# EAGLE design zeitschaltuhr_v2_0_0 (EAGLE 8.2.1)

## Sheet 1 of 2
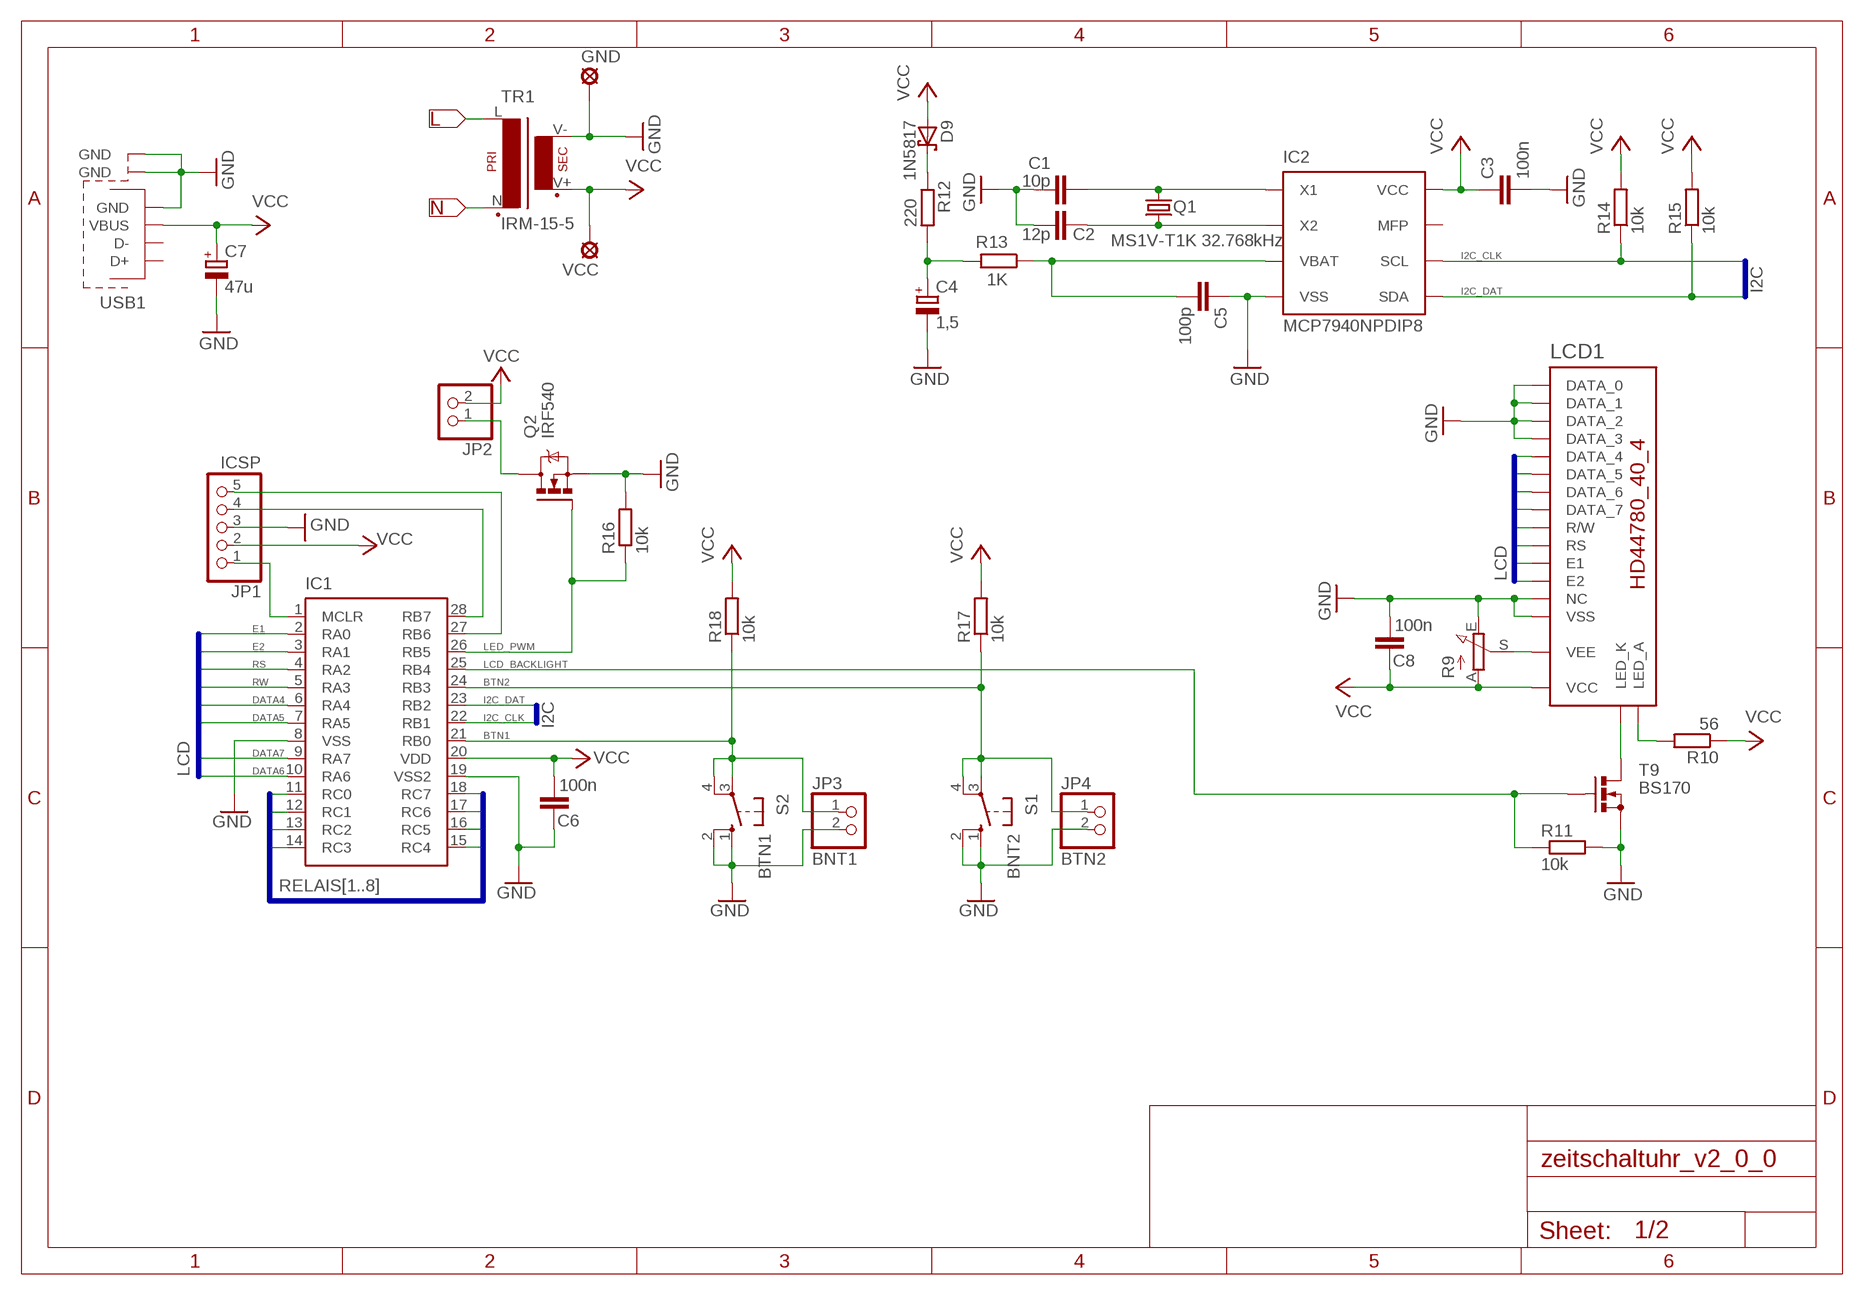
[diagram p0: schematic, sheet 1]

### Parts
C1  10p  C-EU025-024X044  [C025-024X044]
C2  12p  C-EU025-024X044  [C025-024X044]
C3  100n  C-EU025-024X044  [C025-024X044]
C4  1,5  DDL155S05F2CRRDAPZHORIZONTAL  [DDL155S05F2CRRDAPZHORIZONTAL]
C5  100p  C-EU025-024X044  [C025-024X044]
C6  100n  C-EU025-024X044  [C025-024X044]
C7  47u  CPOL-EUE2-5  [E2-5]
C8  100n  C-EU025-024X044  [C025-024X044]
D9  1N5817  SCHOTTKY  [DO41-7]
GND  LSP13  [LSP13]
IC1  PIC18F26K22DIP28  [DIP28]
IC2  MCP7940NPDIP8  [DIL8]
JP1  ICSP  PINHD-1X5  [1X05]
JP2  PINHD-1X2  [1X02]
JP3  BNT1  PINHD-1X2  [1X02]
JP4  BTN2  PINHD-1X2  [1X02]
LCD1  HD44780_4_40  [HD44780_40_4]
Q1  MS1V-T1K 32.768kHz  MS1V-T1KSMD  [MS1V-T1K_SMD]
Q2  IRF540  [TO220BV]
R9  3306P-1-103  [3306P-1-103]
R10  56  R-EU_0207/10  [0207/10]
R11  10k  R-EU_0207/10  [0207/10]
R12  220  R-EU_0207/10  [0207/10]
R13  1K  R-EU_0207/10  [0207/10]
R14  10k  R-EU_0207/10  [0207/10]
R15  10k  R-EU_0207/10  [0207/10]
R16  10k  R-EU_0207/10  [0207/10]
R17  10k  R-EU_0207/10  [0207/10]
R18  10k  R-EU_0207/10  [0207/10]
S1  BNT2  10-XX  [B3F-10XX]
S2  BTN1  10-XX  [B3F-10XX]
T9  BS170  [TO92-]
TR1  IRM-15-5  IRM-15  [IRM-15]
USB1  USB_TYPE_B_THT  [USB_TYPE_B_USB-B-S-RA]
VCC  LSP13  [LSP13]

### Nets
BTN1: IC1.21(RB0) JP3.1 R18.1 S2.3(P) S2.4(P1)
BTN2: IC1.24(RB3) JP4.1 R17.1 S1.3(P) S1.4(P1)
DATA4: IC1.6(RA4) LCD1.4(DATA_4)
DATA5: IC1.7(RA5) LCD1.3(DATA_5)
DATA6: IC1.10(RA6) LCD1.2(DATA_6)
DATA7: IC1.9(RA7) LCD1.1(DATA_7)
E1: IC1.2(RA0) LCD1.9(E1)
E2: IC1.3(RA1) LCD1.15(E2)
GND: C1.1 C2.1 C3.2 C4.- C5.1 C6.1 C7.- C8.2 GND.MP IC1.8(VSS) IC1.19(VSS2) IC2.4(VSS) JP1.3 JP3.2 JP4.2 LCD1.5(DATA_3) LCD1.6(DATA_2) LCD1.7(DATA_1) LCD1.8(DATA_0) LCD1.13(VSS) LCD1.16(NC) Q2.S R9.E R11.2 R16.2 S1.1(S) S1.2(S1) S2.1(S) S2.2(S1) T9.S TR1.V- USB1.GND@1(GND) USB1.GND@2(GND) USB1.GND@3(GND) ; also sheet 2
I2C_CLK: IC1.22(RB1) IC2.6(SCL) R14.1
I2C_DAT: IC1.23(RB2) IC2.5(SDA) R15.1
L: TR1.L ; also sheet 2
LCD_BACKLIGHT: IC1.25(RB4) R11.1 T9.G
LED_A: LCD1.17(LED_A) R10.2
LED_K: LCD1.18(LED_K) T9.D
LED_PWM: IC1.26(RB5) Q2.G R16.1
N: TR1.N ; also sheet 2
N$2: C1.2 IC2.1(X1) Q1.1
N$3: C2.2 IC2.2(X2) Q1.2
N$9: C4.+ R12.2 R13.2
N$10: D9.C R12.1
N$17: C5.2 IC2.3(VBAT) R13.1
N$19: IC1.1(MCLR) JP1.1
N$22: IC1.28(RB7) JP1.4
N$25: IC1.27(RB6) JP1.5
N$35: JP2.1 Q2.D
RELAIS1: IC1.11(RC0) ; also sheet 2
RELAIS2: IC1.12(RC1) ; also sheet 2
RELAIS3: IC1.13(RC2) ; also sheet 2
RELAIS4: IC1.14(RC3) ; also sheet 2
RELAIS5: IC1.15(RC4) ; also sheet 2
RELAIS6: IC1.16(RC5) ; also sheet 2
RELAIS7: IC1.17(RC6) ; also sheet 2
RELAIS8: IC1.18(RC7) ; also sheet 2
RS: IC1.4(RA2) LCD1.11(RS)
RW: IC1.5(RA3) LCD1.10(R/W)
VCC: C3.1 C6.2 C7.+ C8.1 D9.A IC1.20(VDD) IC2.8(VCC) JP1.2 JP2.2 LCD1.14(VCC) R9.A R10.1 R14.2 R15.2 R17.2 R18.2 TR1.V+ USB1.VBUS VCC.MP ; also sheet 2
VEE: LCD1.12(VEE) R9.S
Unconnected: IC2.7(MFP) USB1.D+ USB1.D-

### Buses
RELAIS[1..8]
I2C_CLK,I2C_DAT
E1,E2,RW,RS,DATA[4..7]

### Notes on the sheet
- I2C
- LCD
- I2C
- LCD

## Sheet 2 of 2
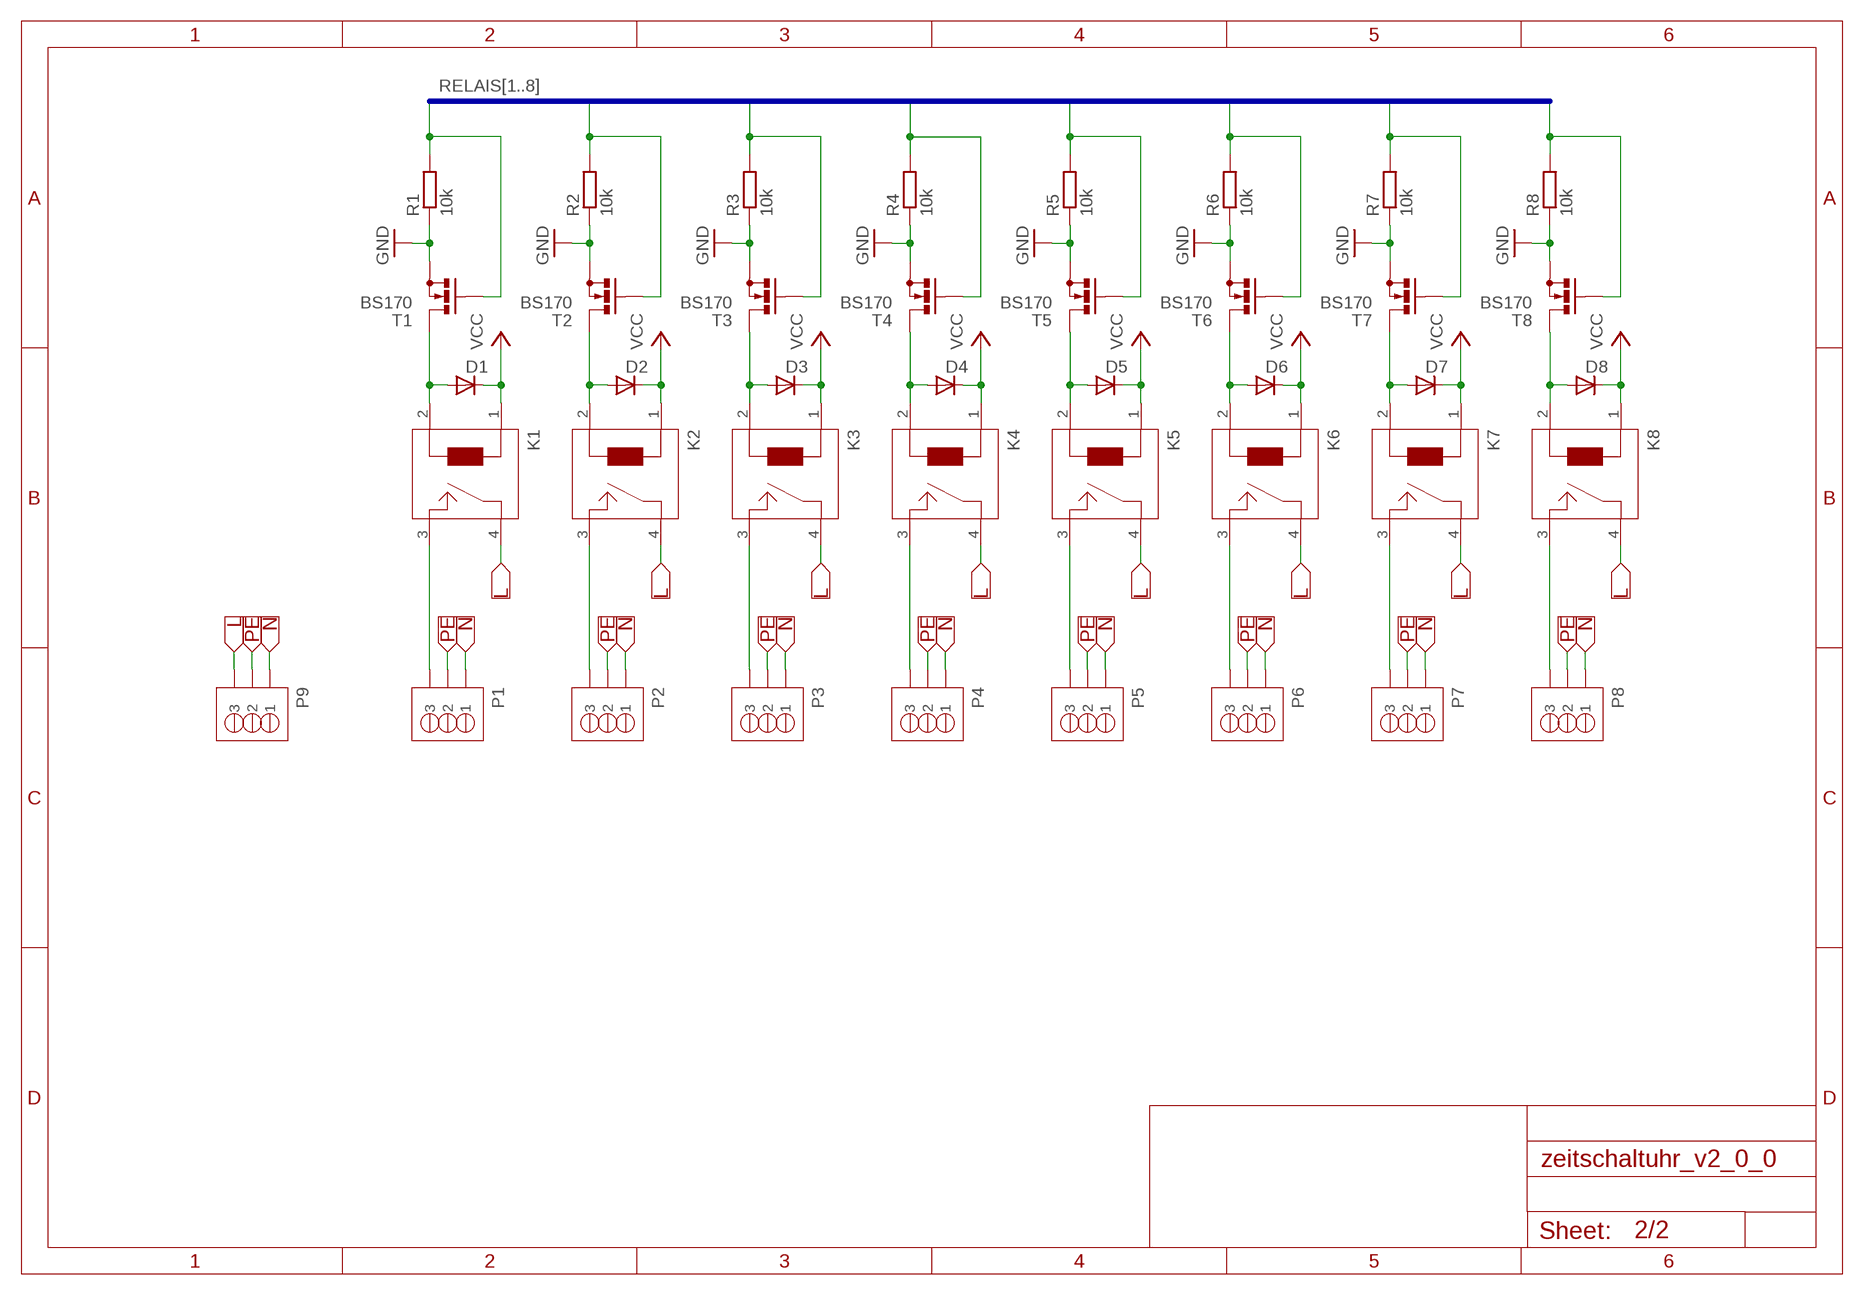
[diagram p1: schematic, sheet 2]

### Parts
D1  1N4148  DIODEDO35-7  [DO35-7]
D2  1N4148  DIODEDO35-7  [DO35-7]
D3  1N4148  DIODEDO35-7  [DO35-7]
D4  1N4148  DIODEDO35-7  [DO35-7]
D5  1N4148  DIODEDO35-7  [DO35-7]
D6  1N4148  DIODEDO35-7  [DO35-7]
D7  1N4148  DIODEDO35-7  [DO35-7]
D8  1N4148  DIODEDO35-7  [DO35-7]
K1  OJE-SS-105HM,000  [OJE-SS-105HM,000]
K2  OJE-SS-105HM,000  [OJE-SS-105HM,000]
K3  OJE-SS-105HM,000  [OJE-SS-105HM,000]
K4  OJE-SS-105HM,000  [OJE-SS-105HM,000]
K5  OJE-SS-105HM,000  [OJE-SS-105HM,000]
K6  OJE-SS-105HM,000  [OJE-SS-105HM,000]
K7  OJE-SS-105HM,000  [OJE-SS-105HM,000]
K8  OJE-SS-105HM,000  [OJE-SS-105HM,000]
P1  TERMINAL_BLOCK_MB310-500M03  [TERMINAL_BLOCK_MB310-500M03]
P2  TERMINAL_BLOCK_MB310-500M03  [TERMINAL_BLOCK_MB310-500M03]
P3  TERMINAL_BLOCK_MB310-500M03  [TERMINAL_BLOCK_MB310-500M03]
P4  TERMINAL_BLOCK_MB310-500M03  [TERMINAL_BLOCK_MB310-500M03]
P5  TERMINAL_BLOCK_MB310-500M03  [TERMINAL_BLOCK_MB310-500M03]
P6  TERMINAL_BLOCK_MB310-500M03  [TERMINAL_BLOCK_MB310-500M03]
P7  TERMINAL_BLOCK_MB310-500M03  [TERMINAL_BLOCK_MB310-500M03]
P8  TERMINAL_BLOCK_MB310-500M03  [TERMINAL_BLOCK_MB310-500M03]
P9  TERMINAL_BLOCK_MB310-500M03  [TERMINAL_BLOCK_MB310-500M03]
R1  10k  R-EU_0207/10  [0207/10]
R2  10k  R-EU_0207/10  [0207/10]
R3  10k  R-EU_0207/10  [0207/10]
R4  10k  R-EU_0207/10  [0207/10]
R5  10k  R-EU_0207/10  [0207/10]
R6  10k  R-EU_0207/10  [0207/10]
R7  10k  R-EU_0207/10  [0207/10]
R8  10k  R-EU_0207/10  [0207/10]
T1  BS170  [TO92-]
T2  BS170  [TO92-]
T3  BS170  [TO92-]
T4  BS170  [TO92-]
T5  BS170  [TO92-]
T6  BS170  [TO92-]
T7  BS170  [TO92-]
T8  BS170  [TO92-]

### Nets
GND: R1.1 R2.1 R3.1 R4.1 R5.1 R6.1 R7.1 R8.1 T1.S T2.S T3.S T4.S T5.S T6.S T7.S T8.S ; also sheet 1
L: K1.4 K2.4 K3.4 K4.4 K5.4 K6.4 K7.4 K8.4 P9.3 ; also sheet 1
N: P1.1 P2.1 P3.1 P4.1 P5.1 P6.1 P7.1 P8.1 P9.1 ; also sheet 1
N$1: D1.A K1.2 T1.D
N$4: D2.A K2.2 T2.D
N$8: D3.A K3.2 T3.D
N$12: D4.A K4.2 T4.D
N$13: K1.3 P1.3
N$14: K2.3 P2.3
N$16: D5.A K5.2 T5.D
N$18: D6.A K6.2 T6.D
N$21: D7.A K7.2 T7.D
N$24: D8.A K8.2 T8.D
N$27: K3.3 P3.3
N$28: K4.3 P4.3
N$29: K5.3 P5.3
N$30: K6.3 P6.3
N$31: K7.3 P7.3
N$32: K8.3 P8.3
PE: P1.2 P2.2 P3.2 P4.2 P5.2 P6.2 P7.2 P8.2 P9.2
RELAIS1: R1.2 T1.G ; also sheet 1
RELAIS2: R2.2 T2.G ; also sheet 1
RELAIS3: R3.2 T3.G ; also sheet 1
RELAIS4: R4.2 T4.G ; also sheet 1
RELAIS5: R5.2 T5.G ; also sheet 1
RELAIS6: R6.2 T6.G ; also sheet 1
RELAIS7: R7.2 T7.G ; also sheet 1
RELAIS8: R8.2 T8.G ; also sheet 1
VCC: D1.C D2.C D3.C D4.C D5.C D6.C D7.C D8.C K1.1 K2.1 K3.1 K4.1 K5.1 K6.1 K7.1 K8.1 ; also sheet 1

### Buses
RELAIS[1..8]

## Library data of the parts
C1-C3 C5 C6 C8 = rcl:C-EU: CAPACITOR, European symbol
C4 = condensator:DDL155S05F2CRRDAPZ: SUPERCAP; DDL155S05F2CRRDAPZ; 1,5F; 5,5V; 0,6Ohm SOURCE: /condensator/DDL155S05F2CRRDAPZ.pdf MANUFACTURER: SAMXON MANUF. NUBMBER: DDL155S05F2CRRDAPZ FARNELL: 2800113 BUY <http://at.farnell.com/samxon/ddl155s05f2crrdapz/doppelschichtkondensator-1-5f/dp/2800113> CONRAD: 457521 - 62 BUY <https://www.conrad.at/de/doppelschicht-kondensator-15-f-5-vdc-20-l-x-b-x-h-175-x-9-x-235-mm-samxon-ddl155s05f2crrdapz-1-st-457521.html>
C7 = rcl:CPOL-EU: POLARIZED CAPACITOR, European symbol
D1-D8 = diode:DIODE: DIODE
D9 = diode:SCHOTTKY: SCHOTTKY-DIODE
GND VCC = solpad:LSP13: SOLDER PAD drill 1.3 mm, distributor Buerklin, 12H562
IC1 = microcontroller:PIC18F26K22: Microcontroller, 8 bit, 18F26k22 SOURCE: /microcontroller/PIC18F26K22.pdf MANUFACTURER: Microchip MANUF. NUMBER: PIC18F26K22 FARNELL: 1814975 BUY <http://at.farnell.com/microchip/pic18f26k22-i-sp/mcu-8bit-64k-flash-xlp-28spdip/dp/1814975?st=pic18f26k22> CONRAD: 651698 - 62 BUY <https://www.conrad.at/de/embedded-mikrocontroller-pic18f26k22-isp-spdip-28-microchip-technology-8-bit-64-mhz-anzahl-io-24-651698.html>
IC2 = microcontroller:MCP7940N: RTCC, MCP7940N SOURCE: /microcontroller/MCP7940N.pdf MANUFACTURER: Microchip MANUF. NUMBER: MCP7940N FARNELL: 2361114 BUY <http://at.farnell.com/microchip/mcp7940n-i-p/echtz-uhr-kal-gp-i2c-64b-sram/dp/2361114?st=mcp7940>
JP1 = pinhead:PINHD-1X5: PIN HEADER
JP2-JP4 = pinhead:PINHD-1X2: PIN HEADER
K1-K8 = relay:OJE-SS-105HM,000: Relay OEG-TE CONNECTIFITY OJE-SS-105HM,000 5VDC, 10A, monostabil, SPST-NO SOURCE: /relay/OJE-SS-105HM_000.pdf MANUFACTURER: OEG-TE CONNECTIFITY MANUF. NUMBER: OJE-SS-105HM,000 FARNELL: 1891661 BUY <http://at.farnell.com/oeg-te-connectivity/oje-ss-105hm-000/relais-spst-no-250vac-30vdc-10a/dp/1891661> OTHER PARTS WITH SAME LAYOUT: CONRAD: 1405623 - 62 BUY <https://www.conrad.at/de/printrelais-5-vdc-10-a-1-schliesser-afe-bj-ss-105lm-1-st-1405623.html>
LCD1 = display:HD44780_4_40: HD44780_40_4 LC-Display SOURCE: /display/HD44780_40_4.pdf MANUFACTURER: EastRising MANUF. NUMBER: ERM4004-1 BUYDISPLAY.COM: ERM4004SBS-1 BUY <http://www.buydisplay.com/default/character-arduino-40x4-lcd-display-datasheet-ks0066-white-on-blue?options=cart>
P1-P9 = connector:TERMINAL_BLOCK_MB310-500M03: TERMINAL_BLOCK MB310-500M03 SOURCE: /connector/TERMINAL_BLOCK_MB310-500M03.pdf MANUFACTURER: DECA MANUF. NUMBER: MB310-500M03 CONRAD: 1188443 - 62 BUY <https://www.conrad.at/de/schraubklemmblock-330-mm-polzahl-3-mb310-500m03-deca-gruen-1-st-1188443.html>
Q1 = crystal:MS1V-T1K: MS1V-T1K WARNING: SMD SOLDERING RECOMMENDED, THT VERSION NOT EXISTING (VIRTUALLY ONLY) SOURCE: /crystal/MS1V-T1K.pdf MANUFACTURER: MicroCrystal MANUF. NUMBER: MS1V-T1K CONRAD: 1009252 - 62 BUY <https://www.conrad.at/de/uhrenquarz-microcrystal-ms1v-t1k-32768khz-7pf-20ppm-ta-qc-smd-2-32768-khz-7-pf-81-mm-2-mm-2-mm-1009252.html>
Q2 = transistor-power:IRF540: HEXFET Power MOSFET
R1-R8 R10-R18 = rcl:R-EU_: RESISTOR, European symbol
R9 = potentiometer:3306P-1-103: Potentiometer 3306P-1-103 MANUFACTURER: BOURNS MANUF. NUMBER: 3306P-1-103 SOURCE: /potentiometer/BOURNS_3306P-1-103.pdf FARNELL: 108239 BUY <http://at.farnell.com/bourns/3306p-1-103/trimmpotentiometer-10k/dp/108239> CONRAD: 447314 - 62 BUY <https://www.conrad.at/de/trimmer-linear-02-w-10-k-260-bourns-3306p-1-103-1-st-447314.html>
S1 S2 = switch-omron:10-XX: OMRON SWITCH; MPN: B3F-1000; OC_FARNELL: 176432; OC_NEWARK: 36M3542
T1-T9 = transistor:BS170: N-CHANNEL MOS FET BS170 SOURCE: /transistor/BS170.pdf MANUFACTURER: OM SEMICONDUCTER MANUF. NUMBER: BS170 FARNELL: 1017687 BUY <http://at.farnell.com/on-semiconductor/bs170/mosfet-n-kanal-500ma-60v-to92/dp/1017687?st=bs170>
TR1 = power:IRM-15: Meanwell IRM-15 Printtrafo SOURCE: /power/AC_DC_IRM-15.pdf MANUFACTURER: MEANWELL MANUF. NUMBER: IRM-15-* (*Output voltage) REICHELT: IRM-15-5 BUY <https://www.reichelt.at/Wandler-Module-AC-DC/IRM-15-5/3/index.html?ACTION=3&LA=2&ARTICLE=157857&GROUPID=7242&artnr=IRM-15-5&trstct=pol_8> CONRAD: 1293871 - 62 BUY <https://www.conrad.at/de/acdc-printnetzteil-mean-well-irm-15-5-5-vdc-3-a-15-w-1293871.html>
USB1 = connector:USB_TYPE_B_THT: USB TYPE B Connector SOURCE: /connector/USB_TYPE_B_USB-B-S-RA.pdf PINOUT: /connector/USB_TYPE_B_PINOUT.jpg MANUFACTURER: multicomp MANUF. NUMBER: USB-B-S-RA FARNELL: 2112373 BUY <http://at.farnell.com/multicomp/usb-b-s-ra/usb-2-0-buchse-typ-b-tht/dp/2112373> OTHER PARTS WITH SAME LAYOUT: CONRAD: 1303504 - 62 BUY <https://www.conrad.at/de/usb-b-printbuchse-buchse-einbau-horizontal-usbbu1b-1-port-econ-connect-inhalt-1-st-1303504.html>

## Board
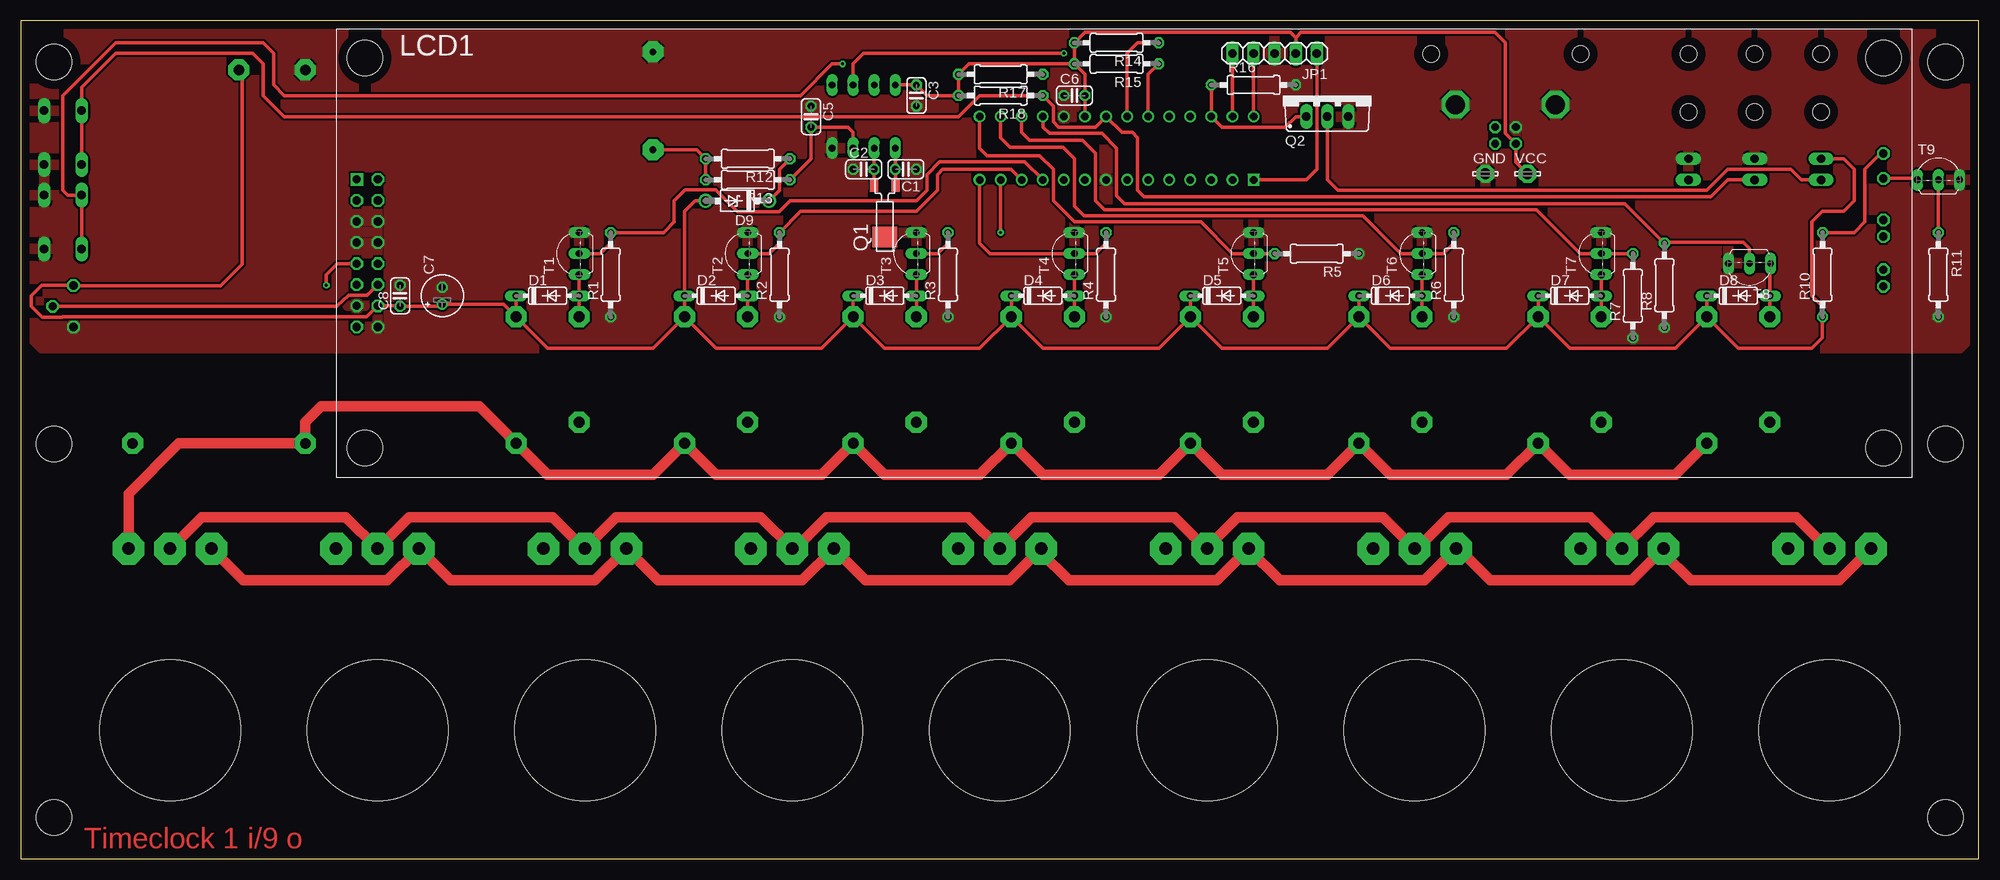
[diagram p2: board, top side]
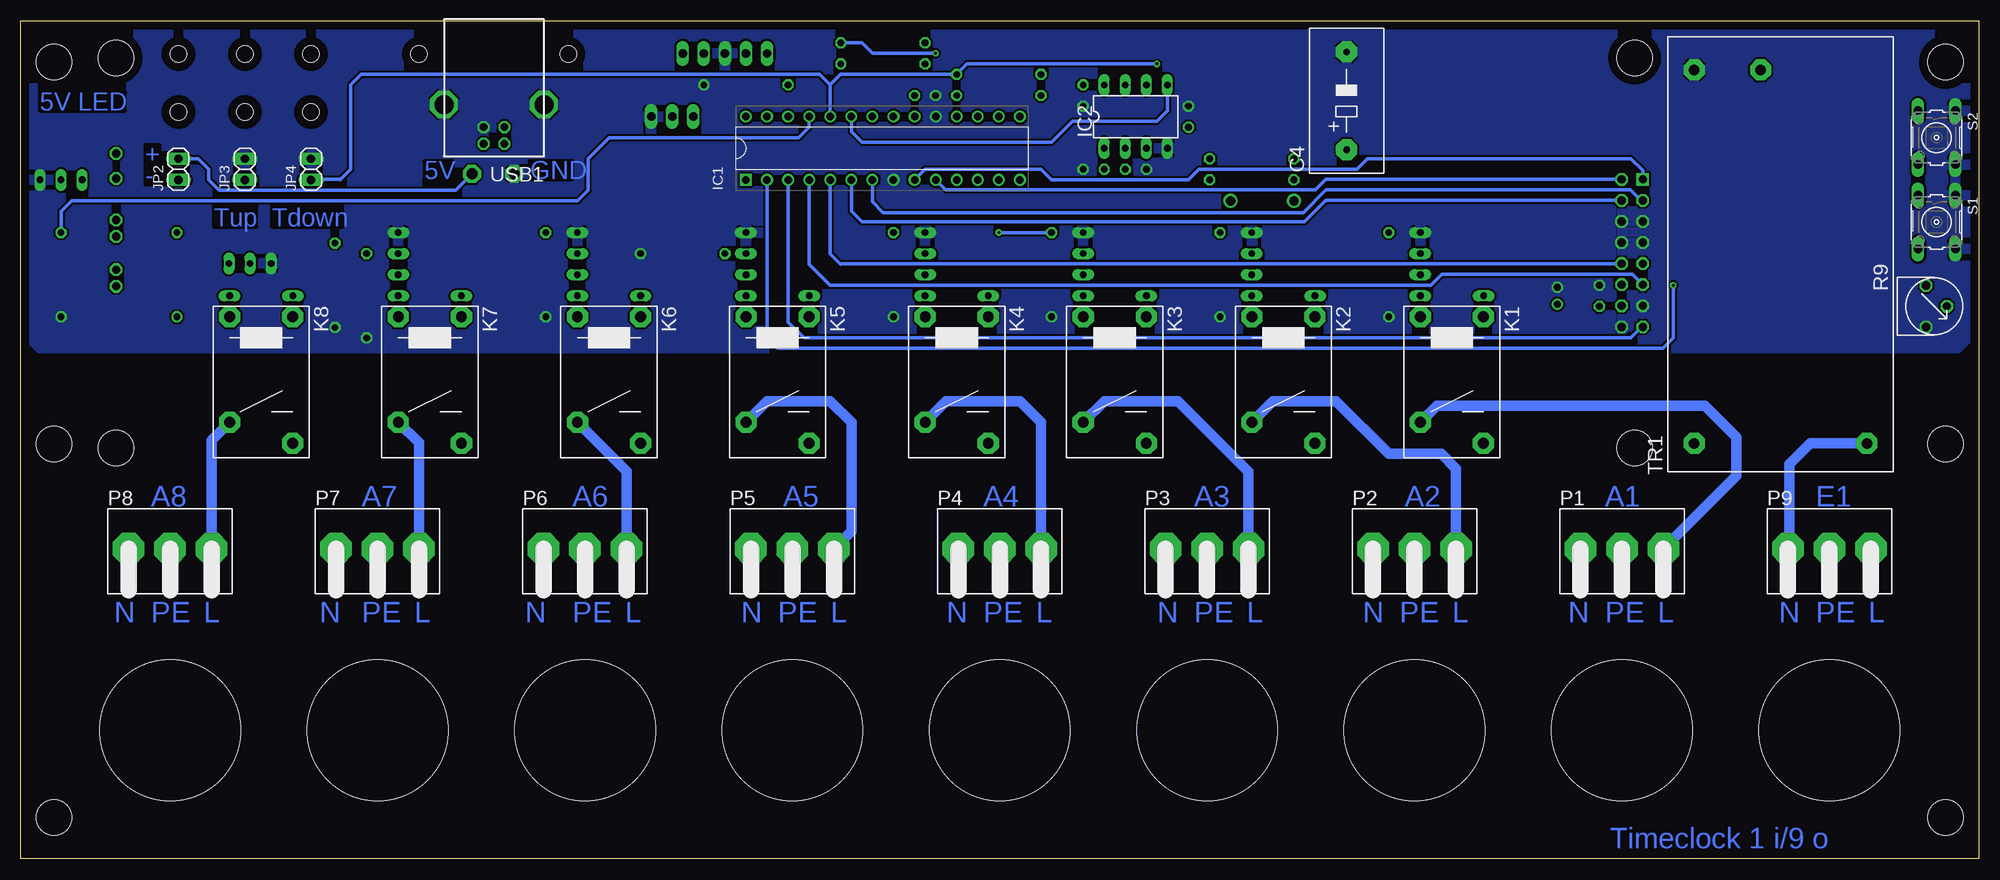
[diagram p3: board, bottom side, seen from below]

Size 236 x 101 mm. Coordinates in mm from the lower left corner, seen from the top.
Outline: 0,0 236,0 236,101 0,101 0,0
Copper layers (1*16): Top 0.035mm / dielectric 1.5mm / Bottom 0.035mm
Design rules "default *": minimum track width 6mil, minimum drill 0.35mm, track to track 10mil, track to pad 10mil, pad to pad 10mil, via to via 10mil, smd to smd 10mil, copper to edge 40mil, drill to drill 6mil, minimum pad ring 10mil, minimum via ring 8mil, stop-mask expansion 4mil, vias tented up to drill 0mil, thermal gap 10mil
Holes 4.3 mm at 232,96 232,50 4,50 4,96 4,5 232,5
Holes 17 mm at 43,15.52 68,15.52 93,15.52 118,15.52 143,15.52 168,15.52 193,15.52 218,15.52 18,15.52
Holes 2 mm at 217,90 209,90 201,90 201,97 209,97 217,97 170,97 188,97
tKeepout: area 213,86 to 221,101; area 205,86 to 213,101; area 197,86 to 205,101

### Footprints (pad centres in the part's own frame; a part is rotated, then mirrored left to right if it is on the bottom)
C025-024X044 = drill 0.813 octagon: 1 -1.27,0; 2 1.27,0
DDL155S05F2CRRDAPZHORIZONTAL = drill 0.8 pad 2.54 octagon: + -5.9,0; - 5.9,0
E2-5 = drill 0.813 pad 1.27: + -1.016,0 | drill 0.813 pad 1.27 octagon: - 1.016,0
DO35-7 = drill 0.813 long: A 3.81,0; C -3.81,0
DO41-7 = drill 1.118: A 3.81,0; C -3.81,0
LSP13 = drill 1.321 pad 2.159 octagon: MP 0,0
DIP28 = drill 0.9 square: 1 -3.81,15.24 | drill 0.9: 2 -3.81,12.7; 3 -3.81,10.16; 4 -3.81,7.62; 5 -3.81,5.08; 6 -3.81,2.54; 7 -3.81,0; 8 -3.81,-2.54; 9 -3.81,-5.08; 10 -3.81,-7.62; 11 -3.81,-10.16; 12 -3.81,-12.7; 13 -3.81,-15.24; 14 -3.81,-17.78; 15 3.81,-17.78; 16 3.81,-15.24; 17 3.81,-12.7; 18 3.81,-10.16; 19 3.81,-7.62; 20 3.81,-5.08; 21 3.81,-2.54; 22 3.81,0; 23 3.81,2.54; 24 3.81,5.08; 25 3.81,7.62; 26 3.81,10.16; 27 3.81,12.7; 28 3.81,15.24
DIL8 = drill 0.813 long: 1 -3.81,-3.81; 2 -1.27,-3.81; 3 1.27,-3.81; 4 3.81,-3.81; 5 3.81,3.81; 6 1.27,3.81; 7 -1.27,3.81; 8 -3.81,3.81
1X05 = drill 1.016 long: 1 -5.08,0; 2 -2.54,0; 3 0,0; 4 2.54,0; 5 5.08,0
1X02 = drill 1.016 long: 1 -1.27,0; 2 1.27,0
OJE-SS-105HM,000 = drill 1.3 pad 2.54 octagon: 1 -6.35,3.8; 2 -6.35,-3.8; 3 6.35,-3.8; 4 8.89,3.8
HD44780_40_4 = drill 1 square: 1 2.5,35.89 | drill 1 octagon: 2 5.04,35.89; 3 2.5,33.35; 4 5.04,33.35; 5 2.5,30.81; 6 5.04,30.81; 7 2.5,28.27; 8 5.04,28.27; 9 2.5,25.73; 10 5.04,25.73; 11 2.5,23.19; 12 5.04,23.19; 13 2.5,20.65; 14 5.04,20.65; 15 2.5,18.11; 16 5.04,18.11; 17 186.5,39; 18 186.5,36 | drill 1 pad 1.27 octagon: P$1 186.5,31; P$2 186.5,29; P$3 186.5,25; P$4 186.5,23 | hole 4.3: 3.5,50.5; 3.5,3.5; 186.5,3.5; 186.5,50.5
TERMINAL_BLOCK_MB310-500M03 = drill 1.5 pad 3.81 octagon: 1 -5,0; 2 0,0; 3 5,0
MS1V-T1K_SMD = smd 1.6 x 1: 1 0,-1.3; 2 0,1.3 | smd 2.5 x 3: NC -6.25,0
TO220BV = drill 1.016 long: D 0,-2.54; G -2.54,-2.54; S 2.54,-2.54
0207/10 = drill 0.813 octagon: 1 -5.08,0; 2 5.08,0
3306P-1-103 = drill 1 octagon: A -2.5,0; E 2.5,0; S 0,2.5
B3F-10XX = drill 1.016 long: 1 -3.251,2.261; 2 3.251,2.261; 3 -3.251,-2.261; 4 3.251,-2.261
TO92- = drill 0.813 long: D -2.54,0; G 0,0; S 2.54,0
IRM-15 = drill 1.27 pad 2.54 octagon: L 0,0; N 0,-20.8; V+ 45,-8; V- 45,0
USB_TYPE_B_USB-B-S-RA = drill 0.92 octagon: D+ -1.25,0; D- -1.25,2; GND@1 1.25,0; VBUS 1.25,2 | drill 2.3 octagon: GND@2 6.02,-2.71; GND@3 -6.02,-2.71

### Placement (x,y rotation side)
C1  106.68,83.1 180 top
C2  101.6,83.1 0 top
C3  107.95,91.99 270 top
C4  76.2,91.36 90 bottom
C5  95.25,89.45 270 top
C6  127,91.99 0 top
C7  50.8,67.86 90 top
C8  45.72,67.86 90 top
D1  63.5,67.86 0 top
D2  83.82,67.86 0 top
D3  104.14,67.86 0 top
D4  123.19,67.86 0 top
D5  144.78,67.86 0 top
D6  165.1,67.86 0 top
D7  186.69,67.86 0 top
D8  207.01,67.86 0 top
D9  86.36,79.29 180 top
GND  176.53,82.55 0 top
IC1  133.35,85.64 90 bottom
IC2  101.6,89.45 0 bottom
JP1  151.13,97.07 180 top
JP2  217,83.1 90 bottom
JP3  209,83.1 90 bottom
JP4  201,83.1 90 bottom
K1  63.5,58.97 270 bottom
K2  83.82,58.97 270 bottom
K3  104.14,58.97 270 bottom
K4  123.19,58.97 270 bottom
K5  144.78,58.97 270 bottom
K6  165.1,58.97 270 bottom
K7  186.69,58.97 270 bottom
K8  207.01,58.97 270 bottom
LCD1  38,46 0 top
P1  43,37.38 0 bottom
P2  68,37.38 0 bottom
P3  93,37.38 0 bottom
P4  118,37.38 0 bottom
P5  143,37.38 0 bottom
P6  168,37.38 0 bottom
P7  193,37.38 0 bottom
P8  218,37.38 0 bottom
P9  18,37.38 0 bottom
Q1  104.14,81.19 90 top
Q2  157.48,91.99 0 top
R1  71.12,70.4 90 top
R2  91.44,70.4 90 top
R3  111.76,70.4 90 top
R4  130.81,70.4 90 top
R5  156.21,72.94 180 top
R6  172.72,70.4 90 top
R7  194.31,67.86 90 top
R8  198.12,69.13 90 top
R9  6.35,66.59 270 bottom
R10  217.17,70.4 90 top
R11  231.14,70.4 270 top
R12  87.63,84.37 180 top
R13  87.63,81.83 180 top
R14  132.08,98.34 180 top
R15  132.08,95.8 180 top
R16  148.59,93.26 0 top
R17  118.11,94.53 180 top
R18  118.11,91.99 180 top
S1  5.08,76.75 270 bottom
S2  5.08,86.91 270 bottom
T1  67.31,72.94 90 top
T2  87.63,72.94 90 top
T3  107.95,72.94 90 top
T4  127,72.94 90 top
T5  148.59,72.94 90 top
T6  168.91,72.94 90 top
T7  190.5,72.94 90 top
T8  208.37,71.75 180 top
T9  231.14,81.83 0 top
TR1  34.29,50.08 90 bottom
USB1  178.96,88.18 180 bottom
VCC  181.61,82.55 0 top

### Tracks (layer width: path | path; a pad name or v marks a point on that pad's centre or on a via)
BTN1
  Top 0.406: S2.4 S2.3 7.34,92.98 11.43,97.07 27.94,97.07 29.21,95.8 29.21,91.99 31.75,89.45 113.03,89.45 115.57,91.99 R18.1 124.46,90.72 124.46,88.81 125.09,88.18 129.54,88.18 IC1.21 132.72,87.55 133.99,87.55 134.62,86.91 134.62,80.56 135.38,79.8 203.71,79.8 205.74,81.83 JP3.1
BTN2  (via drill 0.35)
  Top 0.406: v99.06,95.8 97.79,95.8 93.98,91.99 31.75,91.99 30.48,93.26 30.48,97.07 29.21,98.34 11.43,98.34 5.08,91.99 5.08,80.56 5.64,80 S1.3 S1.4
  Bottom 0.406: 138.43,93.26 137.16,94.53 R17.1 121.92,95.8 v99.06,95.8 | IC1.24 138.43,93.26 | 138.43,93.26 139.7,94.53 194.94,94.53 196.22,93.26 196.22,83.1 197.44,81.87 | 197.44,81.87 197.49,81.83 | 197.44,81.87 200.96,81.87 JP4.1
DATA4
  Bottom 0.406: LCD1.4 78.68,79.35 81.28,76.75 134.62,76.75 135.89,78.02 IC1.6
DATA5
  Bottom 0.406: LCD1.3 40.7,79.35 41.97,80.62 78.68,80.62 81.41,77.89 132.08,77.89 133.35,79.16 IC1.7
DATA6
  Bottom 0.406: LCD1.2 78.68,81.89 79.95,80.62 124.52,80.62 IC1.10
DATA7
  Bottom 0.406: LCD1.1 40.5,82.96 41.91,84.37 73.66,84.37 74.93,83.1 93.98,83.1 95.25,81.83 111.76,81.83 113.03,83.1 127,83.1 IC1.9
E1  (via drill 0.35)
  Top 0.406: LCD1.9 38.16,71.73 36.83,70.4 v36.83,69.13
  Bottom 0.406: IC1.2 146.05,62.78 144.78,61.51 38.1,61.51 36.83,62.78 v36.83,69.13
E2
  Bottom 0.406: IC1.3 143.51,64.69 141.6,62.78 41.91,62.78 40.58,64.11 LCD1.15
GND
  pour Bottom: 1.27,62.78 2.54,61.51 233.68,61.51 234.95,62.78 234.95,98.34 233.68,99.61 2.54,99.61 1.27,98.34
  pour Top: 1.27,62.78 2.54,61.51 233.68,61.51 234.95,62.78 234.95,98.34 233.68,99.61 2.54,99.61 1.27,98.34
I2C_CLK  (via drill 0.35)
  Top 0.406: IC1.22 133.35,97.07 134.62,98.34 R14.1 | IC2.6 100.33,95.8 101.6,97.07 v125.73,97.07
  Bottom 0.406: v125.73,97.07 133.35,97.07 134.62,98.34 R14.1
I2C_DAT
  Top 0.406: IC1.23 135.89,94.53 R15.1
  Bottom 0.406: IC1.23 135.89,87.63 134.62,86.36 111.76,86.36 109.22,88.9 99.06,88.9 97.79,90.17 IC2.5
L
  Top 1.27: K8.4 199.4,46.27 186.69,46.27 K7.4 179.08,46.27 165.1,46.27 K6.4 157.49,46.27 144.78,46.27 K5.4 137.17,46.27 123.19,46.27 K4.4 115.58,46.27 104.14,46.27 K3.4 96.53,46.27 83.82,46.27 K2.4 76.21,46.27 63.5,46.27 K1.4 55.24,54.52 36.2,54.52 34.29,52.62 TR1.L 19.05,50.08 13,44.03 P9.3
LCD_BACKLIGHT
  Top 0.406: T9.G R11.1
  Bottom 0.406: IC1.25 140.97,88.18 142.24,86.91 165.1,86.91 167.64,84.37 167.64,80.56 168.91,79.29 229.87,79.29 231.14,78.02 R11.1
LED_A
  Top 0.406: LCD1.17 224.15,85 222.25,83.1 222.25,76.75 220.98,75.48 R10.2
LED_K
  Top 0.406: LCD1.18 228.43,82 T9.D
LED_PWM
  Top 0.406: R16.1 IC1.26 144.78,88.18 152.4,88.18 153.67,89.45 Q2.G
N
  Top 1.27: P8.1 219.19,33.57 201.28,33.57 198,36.85 P7.1 194.19,33.57 177.15,33.57 173.34,37.38 P6.1 169.19,33.57 151.75,33.57 148,37.32 P5.1 144.19,33.57 126.35,33.57 123,36.92 P4.1 119.19,33.57 101.81,33.57 P3.1 94.19,33.57 76.82,33.57 P2.1 69.19,33.57 51.81,33.57 P1.1 44.19,33.57 26.81,33.57 P9.1
  Bottom 1.27: TR1.N 20.32,50.08 22.86,47.54 22.86,37.52 P9.1
N$1
  Top 0.406: T1.D D1.A K1.2
N$2
  Top 0.406: Q1.1 105.41,81.22 C1.2 IC2.1
N$3
  Top 0.406: Q1.2 102.87,81.22 C2.2 IC2.2
N$4
  Top 0.406: T2.D D2.A K2.2
N$8
  Top 0.406: T3.D D3.A K3.2
N$9
  Top 0.406: R13.2 R12.2 81.47,85.45 C4.+
N$10
  Top 0.406: D9.C 91.44,80.56 91.44,83.1 R12.1
N$12
  Top 0.406: T4.D D4.A K4.2
N$13
  Bottom 1.27: P1.3 29.21,46.17 29.21,50.8 33.02,54.61 65.31,54.61 K1.3
N$14
  Bottom 1.27: P2.3 63,47.04 64.77,48.81 71.12,48.81 77.47,55.16 85.08,55.16 K2.3
N$16
  Top 0.406: T5.D D5.A K5.2
N$17
  Top 0.406: IC2.3 100.33,87.55 99.69,88.18 C5.2 95.25,84.37 R13.1
N$18
  Top 0.406: T6.D D6.A K6.2
N$19
  Top 0.406: IC1.1 154.94,81.83 156.21,83.1 JP1.1
N$21
  Top 0.406: K7.2 D7.A T7.D
N$22
  Top 0.406: JP1.4 IC1.28
N$24
  Top 0.406: K8.2 D8.A 210.82,71.67 T8.D
N$25
  Top 0.406: IC1.27 JP1.5
N$27
  Bottom 1.27: P3.3 88,46.64 96.52,55.16 105.4,55.16 K3.3
N$28
  Bottom 1.27: P4.3 113,52.59 115.57,55.16 124.45,55.16 K4.3
N$29
  Bottom 1.27: P5.3 135.89,39.49 135.89,52.62 138.43,55.16 146.04,55.16 K5.3
N$30
  Bottom 1.27: P6.3 163,46.72 K6.3
N$31
  Bottom 1.27: P7.3 188,50.13 K7.3
N$32
  Bottom 1.27: P8.3 213,50.43 K8.3
N$35
  Top 0.406: Q2.D 157.48,81.83 158.75,80.56 203.2,80.56 205.74,83.1 213.36,83.1 214.63,81.83 JP2.1
PE
  Top 1.27: P8.2 217.79,37.38 213.98,41.19 196.81,41.19 P7.2 189.19,41.19 172.07,41.19 168.26,37.38 P6.2 164.19,41.19 146.67,41.19 143,37.52 P5.2 142.86,37.38 139.05,41.19 121.81,41.19 P4.2 114.19,41.19 97.14,41.19 93.33,37.38 P3.2 89.19,41.19 71.74,41.19 68,37.45 P2.2 67.93,37.38 64.12,41.19 46.81,41.19 P1.2 39.19,41.19 21.81,41.19 P9.2
RELAIS1
  Top 0.406: T1.G 69.85,72.94 71.12,74.21 R1.2 77.47,75.48 78.74,76.75 78.74,79.29 80.07,80.62 83.76,80.62 86.42,77.96 91.38,77.96 92.71,79.29 107.95,79.29 109.22,80.56 109.22,82.47 110.74,83.99 120.97,83.99 IC1.11
RELAIS2
  Top 0.406: T2.G 90.17,72.94 91.44,74.21 R2.2 93.98,78.02 107.95,78.02 110.49,80.56 110.49,82.47 111.12,83.1 119.38,83.1 IC1.12
RELAIS3  (via drill 0.35)
  Top 0.406: T3.G 110.49,72.94 111.76,74.21 R3.2 | v118.11,75.48 IC1.13
  Bottom 0.406: R3.2 v118.11,75.48
RELAIS4
  Top 0.406: R4.2 130.81,74.21 129.54,72.94 T4.G 116.84,72.94 115.57,74.21 IC1.14
RELAIS5
  Top 0.406: IC1.15 115.57,85.64 116.46,84.75 122.81,84.75 124.46,83.1 124.46,79.29 127,76.75 142.24,76.75 146.05,72.94 T5.G R5.2
RELAIS6
  Top 0.406: IC1.16 118.11,86.91 119.25,85.77 125.6,85.77 127,84.37 127,78.66 128.14,77.51 161.8,77.51 166.37,72.94 T6.G 171.45,72.94 172.72,74.21 R6.2
RELAIS7
  Top 0.406: IC1.17 120.65,87.55 121.6,86.59 127.95,86.59 129.54,85 129.54,79.29 130.62,78.21 182.69,78.21 187.96,72.94 T7.G R7.2
RELAIS8
  Top 0.406: IC1.18 123.19,88.18 124.02,87.42 130.3,87.42 132.08,85.64 132.08,79.92 133.03,78.97 193.36,78.97 R8.2 198.21,74.3 207.65,74.3 208.37,73.58 T8.G
RS
  Bottom 0.406: IC1.4 140.97,71.67 138.43,69.13 66.04,69.13 64.71,70.46 41.77,70.46 LCD1.11
RW
  Bottom 0.406: LCD1.10 137.1,71.73 | 137.1,71.73 137.16,71.67 | 137.1,71.73 137.22,71.73 138.43,72.94 IC1.5
VCC
  Top 0.406: K1.1 58.18,66.84 C7.+ 50.55,66.59 C8.1 45.66,66.65 LCD1.14 41.71,65.32 40,65.32 5.08,65.32 5.02,65.26 2.6,65.26 1.27,66.59 1.27,67.86 2.54,69.13 6.31,69.13 R9.A 24.09,69.09 26.67,71.67 26.67,94.7 TR1.V+ | K1.1 D1.C | K2.1 D2.C 80.01,78.02 81.28,79.29 D9.A | K1.1 63.5,61.51 76.21,61.51 K2.1 | K2.1 83.82,61.51 96.53,61.51 K3.1 | K3.1 104.14,61.51 115.58,61.51 K4.1 | K4.1 123.19,61.51 137.17,61.51 K5.1 | K5.1 144.78,61.51 157.49,61.51 K6.1 | K6.1 165.1,61.51 179.08,61.51 K7.1 | K7.1 186.69,61.51 199.4,61.51 K8.1 | K8.1 D8.C | K8.1 207.01,61.51 215.9,61.51 217.17,62.78 R10.1 217.17,66.59 215.9,67.86 215.9,76.75 217.17,78.02 219.71,78.02 220.98,79.29 220.98,83.1 219.71,84.37 JP2.2 | K7.1 D7.C | K6.1 D6.C | K5.1 D5.C | K4.1 D4.C | K3.1 D3.C | IC1.20 C6.2 128.27,94.53 R15.2 | R15.2 R14.2 128.27,99.61 153.03,99.61 153.67,98.97 | R15.2 114.3,95.8 R17.2 R18.2 109.22,91.99 C3.1 IC2.8 | 153.67,98.97 154.31,99.61 177.69,99.61 178.96,98.34 178.96,87.43 USB1.VBUS 180.21,83.95 VCC.MP | JP1.2 153.67,98.97
  Bottom 0.406: VCC.MP 183.6,80.56 212.09,80.56 213.36,81.83 213.36,83.1 214.63,84.37 JP2.2
VEE
  Top 0.406: LCD1.12 41.77,67.92 39.5,67.92 38.1,66.59 R9.S

### Text on the board
Top: Timeclock 1 i/9 o
Bottom: 5V LED | + | GND | 5V | - | Tdown | Tup | E1 | A1 | A2 | A3 | A4 | A5 | A6 | A7 | A8 | L | PE | N | L | PE | N | L | PE | N | L | PE | N | L | PE | N | L | PE | N | L | PE | N | L | PE | N | L | PE | N | Timeclock 1 i/9 o
tStop: Timeclock 1 i/9 o
bStop: 5V LED | + | GND | 5V | - | Tdown | Tup | E1 | A1 | A2 | A3 | A4 | A5 | A6 | A7 | A8 | L | PE | N | L | PE | N | L | PE | N | L | PE | N | L | PE | N | L | PE | N | L | PE | N | L | PE | N | L | PE | N | Timeclock 1 i/9 o